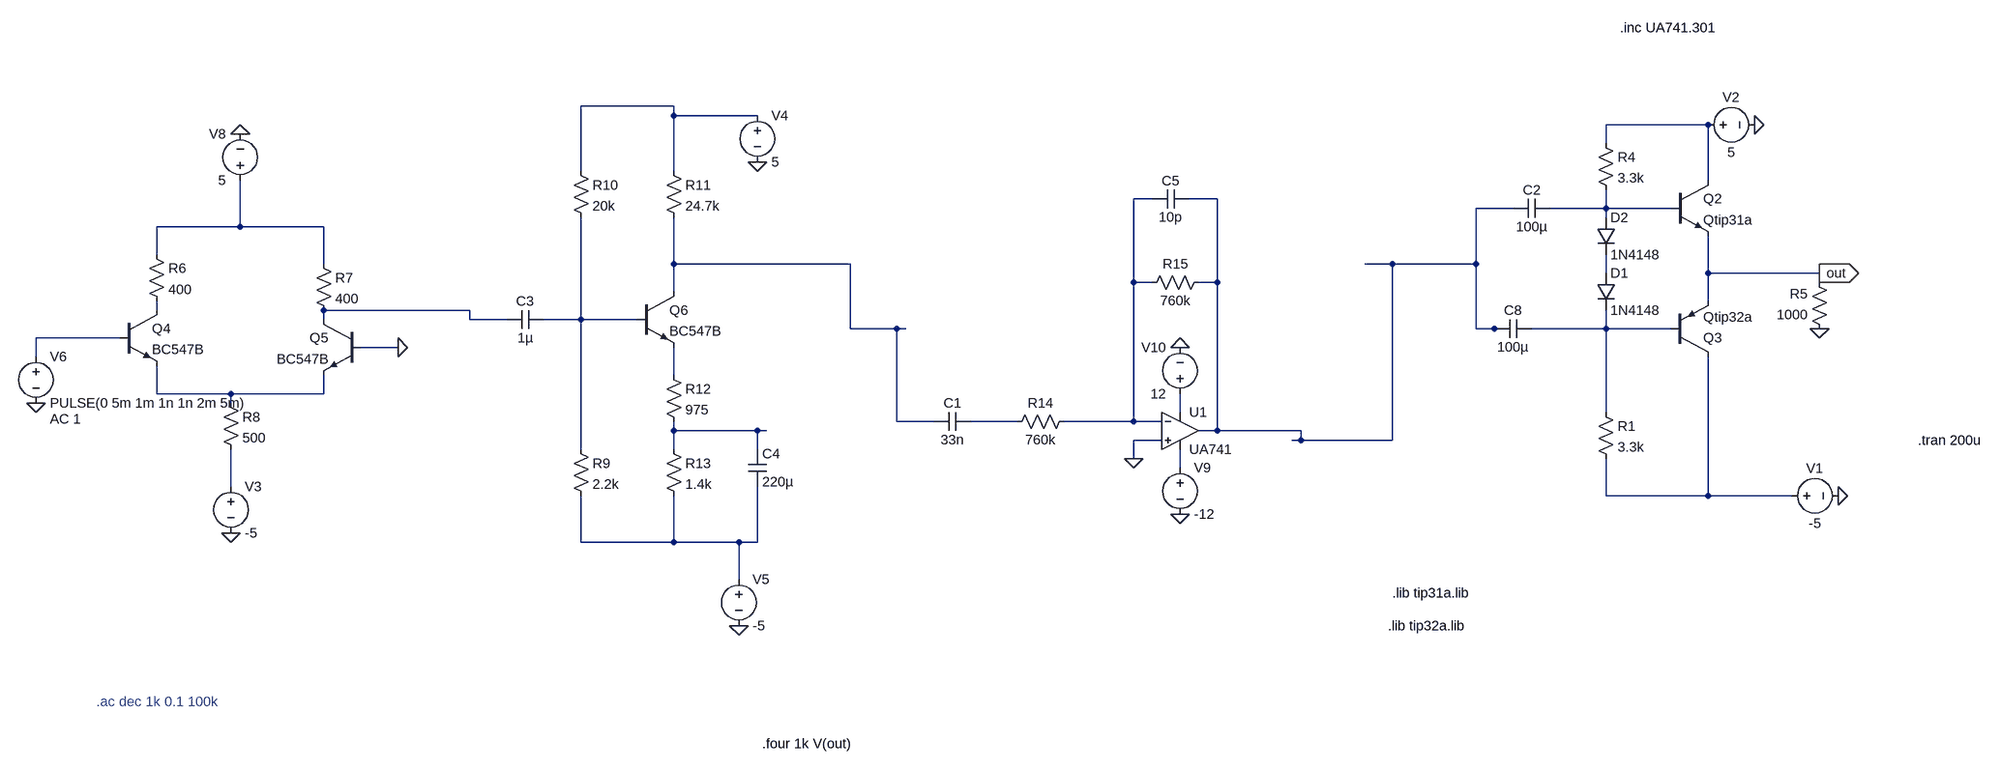
[diagram p0: schematic Full_Circuit.asc]
Full_Circuit.asc, the LTspice schematic file:
Version 4
SHEET 1 1632 1444
WIRE -2240 -48 -2400 -48
WIRE -2240 -32 -2240 -48
WIRE -2096 -32 -2240 -32
WIRE 304 -16 128 -16
WIRE 128 16 128 -16
WIRE -2400 64 -2400 -48
WIRE -2240 64 -2240 -32
WIRE 304 80 304 -16
WIRE -1344 112 -1376 112
WIRE -1232 112 -1280 112
WIRE -32 128 -96 128
WIRE 128 128 128 96
WIRE 128 128 32 128
WIRE 240 128 128 128
WIRE 128 144 128 128
WIRE -3424 160 -3424 80
WIRE -3424 160 -3568 160
WIRE -3280 160 -3424 160
WIRE -3568 208 -3568 160
WIRE -3280 224 -3280 160
WIRE -2240 224 -2240 144
WIRE -1936 224 -2240 224
WIRE -240 224 -288 224
WIRE -96 224 -96 128
WIRE -96 224 -240 224
WIRE 128 240 128 208
WIRE 304 240 304 176
WIRE 496 240 304 240
WIRE -1376 256 -1376 112
WIRE -1344 256 -1376 256
WIRE -1232 256 -1232 112
WIRE -1232 256 -1264 256
WIRE 496 256 496 240
WIRE -2240 272 -2240 224
WIRE 304 288 304 240
WIRE -3568 304 -3568 288
WIRE -2592 304 -3280 304
WIRE -3280 320 -3280 304
WIRE -2592 320 -2592 304
WIRE -2528 320 -2592 320
WIRE -2400 320 -2400 144
WIRE -2400 320 -2464 320
WIRE -2304 320 -2400 320
WIRE -1936 336 -1936 224
WIRE -1856 336 -1936 336
WIRE -1840 336 -1856 336
WIRE -96 336 -96 224
WIRE -64 336 -96 336
WIRE -48 336 -64 336
WIRE 128 336 128 304
WIRE 128 336 0 336
WIRE 240 336 128 336
WIRE -3632 352 -3776 352
WIRE -3152 368 -3216 368
WIRE -3776 384 -3776 352
WIRE -2240 416 -2240 368
WIRE -3568 448 -3568 400
WIRE -3440 448 -3568 448
WIRE -3280 448 -3280 416
WIRE -3280 448 -3440 448
WIRE -3440 464 -3440 448
WIRE -1296 480 -1296 448
WIRE 128 480 128 336
WIRE -1856 496 -1856 336
WIRE -1792 496 -1856 496
WIRE -1648 496 -1728 496
WIRE -1376 496 -1376 256
WIRE -1376 496 -1568 496
WIRE -1328 496 -1376 496
WIRE -2240 512 -2240 496
WIRE -2096 512 -2240 512
WIRE -2080 512 -2096 512
WIRE -1232 512 -1232 256
WIRE -1232 512 -1264 512
WIRE -704 512 -1232 512
WIRE -1328 528 -1376 528
WIRE -704 528 -704 512
WIRE -704 528 -720 528
WIRE -240 528 -240 224
WIRE -240 528 -704 528
WIRE -2400 544 -2400 320
WIRE -2240 544 -2240 512
WIRE -2096 544 -2096 512
WIRE -1376 560 -1376 528
WIRE -1296 576 -1296 544
WIRE -3440 608 -3440 544
WIRE 128 624 128 560
WIRE 304 624 304 384
WIRE 304 624 128 624
WIRE 448 624 304 624
WIRE -2400 704 -2400 624
WIRE -2240 704 -2240 624
WIRE -2240 704 -2400 704
WIRE -2128 704 -2240 704
WIRE -2096 704 -2096 608
WIRE -2096 704 -2128 704
WIRE -2128 768 -2128 704
FLAG 496 336 0
FLAG 496 240 out
IOPIN 496 240 Out
FLAG 528 624 0
FLAG 384 -16 0
FLAG -3440 688 0
FLAG -2096 48 0
FLAG -2128 848 0
FLAG -3424 0 0
FLAG -3776 464 0
FLAG -1376 560 0
FLAG -1296 368 0
FLAG -1296 656 0
FLAG -3152 368 0
SYMBOL Res 112 464 R0
SYMATTR InstName R1
SYMATTR Value 3.3k
SYMBOL diode 112 240 R0
SYMATTR InstName D1
SYMATTR Value 1N4148
SYMBOL diode 112 144 R0
SYMATTR InstName D2
SYMATTR Value 1N4148
SYMBOL Res 112 0 R0
SYMATTR InstName R4
SYMATTR Value 3.3k
SYMBOL npn 240 80 R0
SYMATTR InstName Q2
SYMATTR Value Qtip31a
SYMBOL pnp 240 384 M180
SYMATTR InstName Q3
SYMATTR Value Qtip32a
SYMBOL Res 512 352 R180
WINDOW 0 36 76 Left 2
WINDOW 3 36 40 Left 2
SYMATTR InstName R5
SYMATTR Value 1000
SYMBOL Voltage 432 624 R270
WINDOW 0 32 56 VTop 2
WINDOW 3 -32 56 VBottom 2
SYMATTR InstName V1
SYMATTR Value -5
SYMBOL Voltage 288 -16 R270
WINDOW 0 32 56 VTop 2
WINDOW 3 -32 56 VBottom 2
SYMATTR InstName V2
SYMATTR Value 5
SYMBOL npn -3632 304 R0
SYMATTR InstName Q4
SYMATTR Value BC547B
SYMBOL npn -3216 320 M0
SYMATTR InstName Q5
SYMATTR Value BC547B
SYMBOL res -3584 192 R0
SYMATTR InstName R6
SYMATTR Value 400
SYMBOL res -3296 208 R0
SYMATTR InstName R7
SYMATTR Value 400
SYMBOL res -3456 448 R0
SYMATTR InstName R8
SYMATTR Value 500
SYMBOL voltage -3440 592 R0
WINDOW 123 0 0 Left 0
WINDOW 39 0 0 Left 0
SYMATTR InstName V3
SYMATTR Value -5
SYMBOL npn -2304 272 R0
SYMATTR InstName Q6
SYMATTR Value BC547B
SYMBOL res -2416 528 R0
SYMATTR InstName R9
SYMATTR Value 2.2k
SYMBOL res -2416 48 R0
SYMATTR InstName R10
SYMATTR Value 20k
SYMBOL res -2256 48 R0
SYMATTR InstName R11
SYMATTR Value 24.7k
SYMBOL voltage -2096 -48 R0
WINDOW 123 0 0 Left 0
WINDOW 39 0 0 Left 0
SYMATTR InstName V4
SYMATTR Value 5
SYMBOL voltage -2128 752 R0
WINDOW 123 0 0 Left 0
WINDOW 39 0 0 Left 0
SYMATTR InstName V5
SYMATTR Value -5
SYMBOL voltage -3776 368 R0
WINDOW 123 24 124 Left 2
WINDOW 39 0 0 Left 0
SYMATTR Value2 AC 1
SYMATTR InstName V6
SYMATTR Value PULSE(0 5m 1m 1n 1n 2m 5m)
SYMBOL voltage -3424 96 R180
WINDOW 0 24 96 Left 2
WINDOW 3 24 16 Left 2
WINDOW 123 0 0 Left 0
WINDOW 39 0 0 Left 0
SYMATTR InstName V8
SYMATTR Value 5
SYMBOL cap -2464 304 R90
WINDOW 0 0 32 VBottom 2
WINDOW 3 32 32 VTop 2
SYMATTR InstName C3
SYMATTR Value 1µ
SYMBOL res -2256 400 R0
SYMATTR InstName R12
SYMATTR Value 975
SYMBOL res -2256 528 R0
SYMATTR InstName R13
SYMATTR Value 1.4k
SYMBOL cap -2112 544 R0
SYMATTR InstName C4
SYMATTR Value 220µ
SYMBOL OpAmps/opamp2 -1296 448 R0
SYMATTR InstName U1
SYMATTR Value UA741
SYMBOL Voltage -1296 560 R0
SYMATTR InstName V9
SYMATTR Value -12
SYMBOL Voltage -1296 464 R180
WINDOW 0 24 96 Left 2
WINDOW 3 24 16 Left 2
SYMATTR InstName V10
SYMATTR Value 12
SYMBOL Cap -1728 480 R90
WINDOW 0 0 32 VBottom 2
WINDOW 3 32 32 VTop 2
SYMATTR InstName C1
SYMATTR Value 33n
SYMBOL Res -1552 480 R90
WINDOW 0 0 56 VBottom 2
WINDOW 3 32 56 VTop 2
SYMATTR InstName R14
SYMATTR Value 760k
SYMBOL Res -1248 240 R90
WINDOW 0 0 56 VBottom 2
WINDOW 3 32 56 VTop 2
SYMATTR InstName R15
SYMATTR Value 760k
SYMBOL Cap -1280 96 R90
WINDOW 0 0 32 VBottom 2
WINDOW 3 32 32 VTop 2
SYMATTR InstName C5
SYMATTR Value 10p
SYMBOL cap 32 112 R90
WINDOW 0 0 32 VBottom 2
WINDOW 3 32 32 VTop 2
SYMATTR InstName C2
SYMATTR Value 100µ
SYMBOL cap 0 320 R90
WINDOW 0 0 32 VBottom 2
WINDOW 3 32 32 VTop 2
SYMATTR InstName C8
SYMATTR Value 100µ
TEXT 696 528 Left 2 !.tran 200u
TEXT 152 -472 Left 2 !.inc UA741.301
TEXT -3672 1056 Left 2 ;.ac dec 1k 0.1 100k
TEXT -240 792 Left 2 !.lib tip31a.lib
TEXT -248 848 Left 2 !.lib tip32a.lib
TEXT -2088 1128 Left 2 !.four 1k V(out)
LINE Normal 128 484 128 480 2

The netlist it stands for:
* Full_Circuit.asc
R1 N012 N021 3.3k
D1 N008 N012 1N4148
D2 N005 N008 1N4148
R4 N002 N005 3.3k
Q2 N002 N005 out 0 Qtip31a
Q3 N021 N012 out 0 Qtip32a
R5 0 out 1000
V1 N021 0 -5
V2 N002 0 5
Q4 N009 N013 N015 0 BC547B
Q5 N010 0 N015 0 BC547B
R6 N006 N009 400
R7 N006 N010 400
R8 N015 N020 500
V3 N020 0 -5
Q6 N007 N011 N014 0 BC547B
R9 N011 N022 2.2k
R10 N001 N011 20k
R11 N001 N007 24.7k
V4 N001 0 5
V5 N022 0 -5
V6 N013 0 PULSE(0 5m 1m 1n 1n 2m 5m) AC 1
V8 N006 0 5
C3 N011 N010 1µ
R12 N014 N018 975
R13 N018 N022 1.4k
C4 N018 N022 220µ
XU1 0 N003 N016 N019 N004 UA741  ; pins In+ In- V+ V- OUT
V9 N019 0 -12
V10 N016 0 12
C1 N017 N007 33n
R14 N003 N017 760k
R15 N004 N003 760k
C5 N004 N003 10p
C2 N005 N004 100µ
C8 N012 N004 100µ
.model D D
.lib standard.dio
.model NPN NPN
.model PNP PNP
.lib standard.bjt
.tran 200u
.inc UA741.301
* .ac dec 1k 0.1 100k
.lib tip31a.lib
.lib tip32a.lib
.four 1k V(out)
.backanno
.end